# Altium schematic sheet ADC.SchDoc
size A4
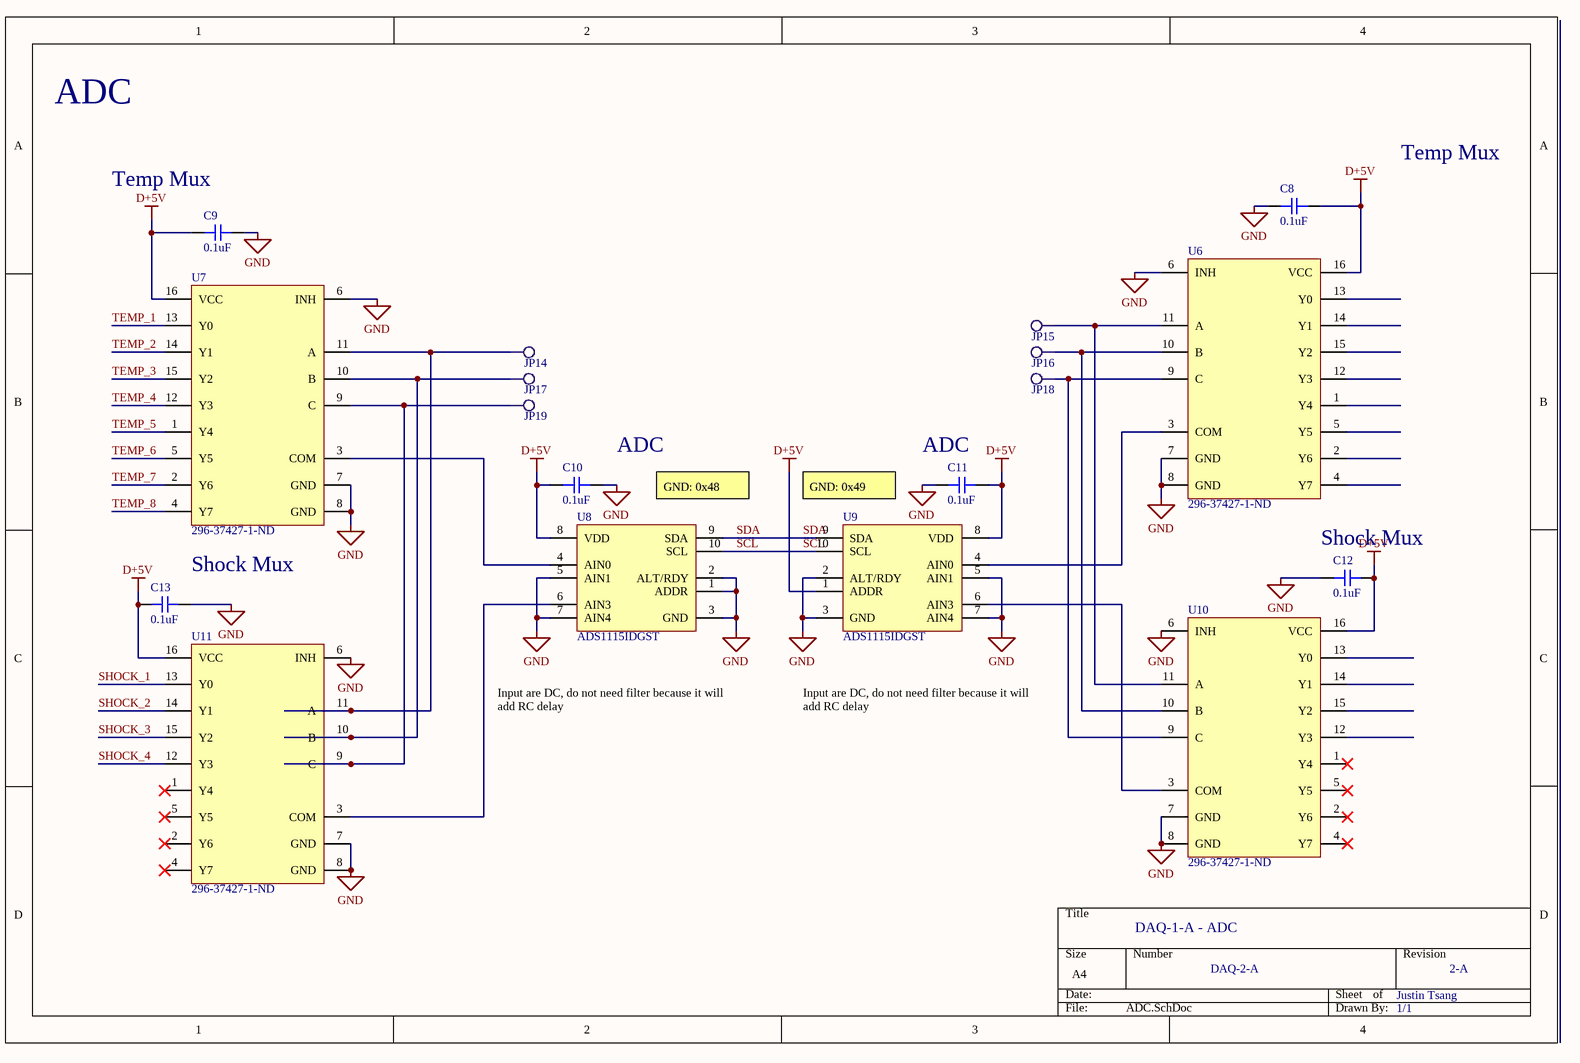
[diagram p0: ADC.SchDoc]

## Parts
C8  0.1uF  [CAP-0603]
C9  0.1uF  [CAP-0603]
C10  0.1uF  [CAP-0603]
C11  0.1uF  [CAP-0603]
C12  0.1uF  [CAP-0603]
C13  0.1uF  [CAP-0603]
JP14  Testpoint2  [TP2]  (value not drawn)
JP15  Testpoint2  [TP2]  (value not drawn)
JP16  Testpoint2  [TP2]  (value not drawn)
JP17  Testpoint2  [TP2]  (value not drawn)
JP18  Testpoint2  [TP2]  (value not drawn)
JP19  Testpoint2  [TP2]  (value not drawn)
U6  296-37427-1-ND  [16-SOIC]
U7  296-37427-1-ND  [16-SOIC]
U8  ADS1115IDGST  [VSSOP50P310X310-10P]
U9  ADS1115IDGST  [VSSOP50P310X310-10P]
U10  296-37427-1-ND  [16-SOIC]
U11  296-37427-1-ND  [16-SOIC]

## Nets
D+5V: C8.2 C9.2 C10.2 C11.2 C12.2 C13.2 U6.16(VCC) U7.16(VCC) U8.8(VDD) U9.1(ADDR) U9.8(VDD) U10.16(VCC) U11.16(VCC)
GND: C8.1 C9.1 C10.1 C11.1 C12.1 C13.1 U6.6(INH) U6.7(GND) U6.8(GND) U7.6(INH) U7.7(GND) U7.8(GND) U8.1(ADDR) U8.2(ALT/RDY) U8.3(GND) U8.5(AIN1) U8.7(AIN4) U9.2(ALT/RDY) U9.3(GND) U9.5(AIN1) U9.7(AIN4) U10.6(INH) U10.7(GND) U10.8(GND) U11.6(INH) U11.7(GND) U11.8(GND)
SCL: U8.10(SCL) U9.10(SCL)
SDA: U8.9(SDA) U9.9(SDA)
SHOCK_1: U11.13(Y0)
SHOCK_2: U11.14(Y1)
SHOCK_3: U11.15(Y2)
SHOCK_4: U11.12(Y3)
TEMP_1: U7.13(Y0)
TEMP_2: U7.14(Y1)
TEMP_3: U7.15(Y2)
TEMP_4: U7.12(Y3)
TEMP_5: U7.1(Y4)
TEMP_6: U7.5(Y5)
TEMP_7: U7.2(Y6)
TEMP_8: U7.4(Y7)
NetJP14_1: JP14.1 U7.11(A) U11.11(A)
NetJP15_1: JP15.1 U6.11(A) U10.11(A)
NetJP16_1: JP16.1 U6.10(B) U10.10(B)
NetJP17_1: JP17.1 U7.10(B) U11.10(B)
NetJP18_1: JP18.1 U6.9(C) U10.9(C)
NetJP19_1: JP19.1 U7.9(C) U11.9(C)
NetU6_3: U6.3(COM) U9.4(AIN0)
NetU7_3: U7.3(COM) U8.4(AIN0)
NetU8_6: U8.6(AIN3) U11.3(COM)
NetU9_6: U9.6(AIN3) U10.3(COM)

Not connected (* = marked no-connect by the designer): U6 1(Y4) 2(Y6) 4(Y7) 5(Y5) 12(Y3) 13(Y0) 14(Y1) 15(Y2); U10 1(Y4)* 2(Y6)* 4(Y7)* 5(Y5)* 12(Y3) 13(Y0) 14(Y1) 15(Y2); U11 1(Y4)* 2(Y6)* 4(Y7)* 5(Y5)*

## Notes on the sheet
- ADC
- (near C9) Temp Mux
- (near C8) Temp Mux
- (near C10) ADC
- (near C11) ADC
- (near U8) GND: 0x48
- GND: 0x49
- Shock Mux
- Input are DC, do not need filter because it will add RC delay
- DAQ-1-A - ADC
- DAQ-2-A
- Justin Tsang
- 2-A
- 1/1

## Library data of the parts
C8-C13 = 0603-0.1uF-16V: CAP CER 0.1UF 16V X7R 0603; Manufacturer: KEMET; Manufacturer Part Number: C0603C104M4RACTU; Dielectric Material: Ceramic; Capacitance: 100nF; Tolerance: 20%; Supplier 1: Digi-Key; Stock 1: 254524; Pricing 1: 1=0.1, 10=0.036, 100=0.0161, 500=0.01152, 1000=0.00904 (USD); Mount: Surface Mount,PCB; Case/Package: 0603; Number of Pins: 2; Case Code (Metric): 1608; Case Code (Imperial): 0603; Min Operating Temperature: -55°C; Max Operating Temperature: 125°C; Package Quantity: 1; Voltage Rating: 16V; Packaging: Tape and Reel; Voltage Rating (DC): 16V; Dielectric: X7R; Termination: SMD/SMT; Length: 1.6mm; Height: 0.8mm; Width: 0.031inch; Thickness: 0.034inch; Lead Pitch: 0.7mm; Depth: 0.8mm; Radiation Hardening: No; REACH SVHC: No SVHC; ComponentLink1URL: https://www.verical.com/server-webapp/html/getDatasheet?partID=66190&src-supplier=Verical; ComponentLink1Description: https://www.verical.com/server-webapp/html/getDatasheet?partID=66190&src-supplier=Verical; ComponentLink2URL: http://www.farnell.com/datasheets/2746055.pdf?src-supplier=Element14; ComponentLink2Description: http://www.farnell.com/datasheets/2746055.pdf?src-supplier=Element14; ComponentLink3URL: http://www.farnell.com/datasheets/2123765.pdf?src-supplier=Element14; ComponentLink3Description: http://www.farnell.com/datasheets/2123765.pdf?src-supplier=Element14; ComponentLink4URL: http://www.alliedelec.com/m/d/9bfe7773041ffe9d406e68bc7b377fdd.pdf?src-supplier=Allied+Electronics; ComponentLink4Description: http://www.alliedelec.com/m/d/9bfe7773041ffe9d406e68bc7b377fdd.pdf?src-supplier=Allied+Electronics; ComponentLink5URL: https://www.verical.com/server-webapp/html/getDatasheet?partID=302288&src-supplier=Verical; ComponentLink5Description: https://www.verical.com/server-webapp/html/getDatasheet?partID=302288&src-supplier=Verical; Supplier Part Number 1: 399-1099-6-ND
JP14-JP19 = Testpoint2: Single layer pad TP
U6 U7 U10 U11 = MUX-SN74LV4051ATDWRQ1: IC MUX/DEMUX 8X1 16SOIC; Manufacturer: Texas Instruments; Max Supply Voltage: 5.5V; Min Supply Voltage: 2V; Bandwidth: 35MHz; Propagation Delay: 7ns; Number of Inputs: 8; Number of Outputs: 1; Logic Function: Multiplexer,Demultiplexer; On-State Resistance: 75R; Operating Supply Current: 20uA; Turn-On Delay Time: 20ns; Supply Type: Single; Supplier 1: Digi-Key; Manufacturer Part Number: SN74LV4051ATDWRQ1; Stock 1: 2359; Pricing 1: 1=0.7, 10=0.617, 25=0.5796, 100=0.4731, 250=0.43944, 500=0.374, 1000=0.2992 (USD); Mount: Surface Mount; Case/Package: SOIC; Number of Pins: 16; Weight: 0.014829oz; Min Operating Temperature: -40°C; Max Operating Temperature: 105°C; Packaging: Tape and Reel; Package Quantity: 2000; Number of Channels: 1; Turn-Off Delay Time: 20ns; Number of Circuits: 1; -3db Bandwidth: 35MHz; Number of Bits: 8; Radiation Hardening: No; Lead Free: Lead Free; ComponentLink1URL: https://www.verical.com/server-webapp/html/getDatasheet?partID=348177&src-supplier=Verical; ComponentLink1Description: https://www.verical.com/server-webapp/html/getDatasheet?partID=348177&src-supplier=Verical; ComponentLink2URL: http://focus.ti.com/lit/ds/symlink/sn74lv4051a-q1.pdf?src-supplier=Avnet; ComponentLink2Description: http://focus.ti.com/lit/ds/symlink/sn74lv4051a-q1.pdf?src-supplier=Avnet; ComponentLink3URL: http://www.ti.com/lit/ds/symlink/sn74lv4051a-q1.pdf?src-supplier=Digi-Key; ComponentLink3Description: http://www.ti.com/lit/ds/symlink/sn74lv4051a-q1.pdf?src-supplier=Digi-Key; Supplier Part Number 1: 296-37427-6-ND
U8 U9 = IC_ADS1115: TEXAS INSTRUMENTS - ADS1115IDGST . - Analogue to Digital Converter, 16 bit, 860 SPS, Differential, Single Ended, I2C, Single, 2 V; Sampling Rate: 860S/s; Number of A/D Converters: 1; Number of Bits: 16; Resolution: 16b; Polarity: Bipolar; Number of Inputs: 4; Min Supply Voltage: 2V; Max Supply Voltage: 5.5V; Conversion Rate: 0.86KS/s; Integral Nonlinearity (INL): 1LSB; Power Dissipation: 900uW; Supplier 1: Digi-Key; Manufacturer: Texas Instruments; RoHS: Yes; Category: Analog to Digital Converters (ADCs); Stock 1: 7435; Pricing 1: 1=5.62000, 10=5.04600, 25=4.77000, 100=3.92200, 250=3.51920, 500=3.39200, 1000=2.81960 (USD); Case/Package: VSSOP; Number of Pins: 10; Contact Plating: Gold; Min Operating Temperature: -40°C; Max Operating Temperature: 125°C; Interface: I2C; Package Quantity: 2500; Packaging: Tape and Reel; Supply Type: Single; Number of Converters: 1; Max Supply Voltage (DC): 5.5V; Min Supply Voltage (DC): 2V; Series: -; Radiation Hardening: No; RoHS Compliant: Yes; Lead Free: Lead Free; REACH SVHC: No SVHC; ComponentLink1URL: https://datasheet.ciiva.com/4031/47725463s8438921n7713-4031028.pdf?src-supplier=Arrow+Electronics; ComponentLink1Description: https://datasheet.ciiva.com/4031/47725463s8438921n7713-4031028.pdf?src-supplier=Arrow+Electronics; ComponentLink2URL: https://datasheet.ciiva.com/1304/ads1113-1304266.pdf?src-supplier=Digi-Key; ComponentLink2Description: https://datasheet.ciiva.com/1304/ads1113-1304266.pdf?src-supplier=Digi-Key; ComponentLink3URL: https://datasheet.ciiva.com/25993/sbas444b-25993205.pdf?src-supplier=Avnet+Europe; ComponentLink3Description: https://datasheet.ciiva.com/25993/sbas444b-25993205.pdf?src-supplier=Avnet+Europe; Manufacturer Part Number: ADS1115IDGST; Supplier Part Number 1: 296-24934-1-ND